# Altium project freedomport.PrjPcb
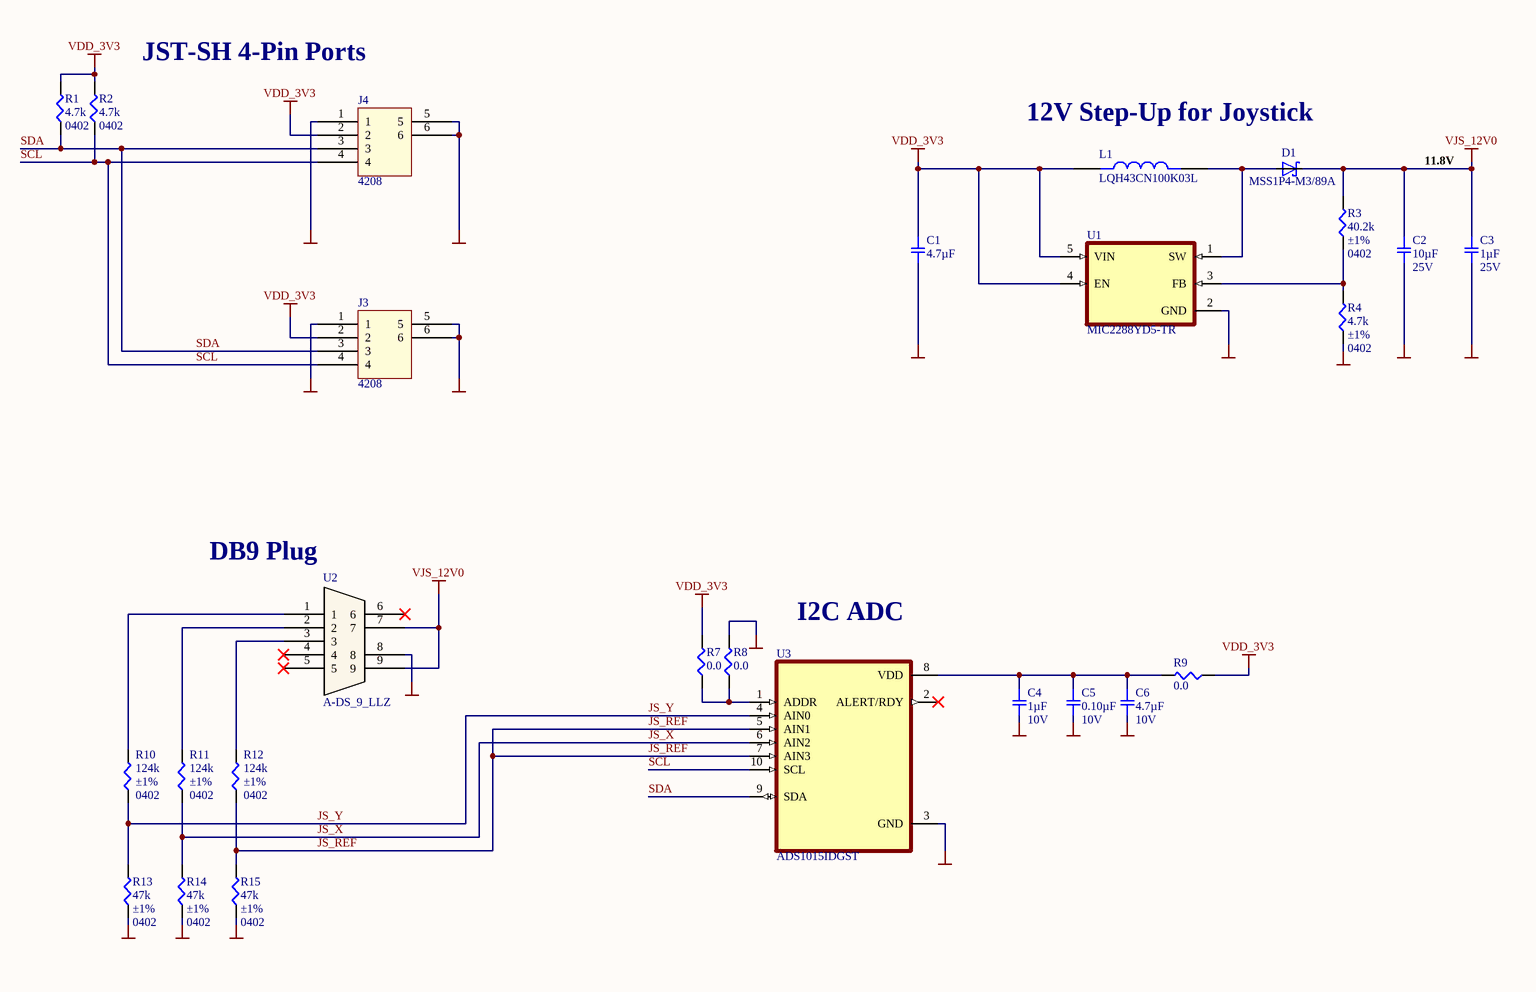
[diagram p0: freedomport.SchDoc]
1 sheet, 26 parts. Net scope: global (net labels, ports and power ports of the same name join across sheets).
Board file: freedomport.PcbDoc

## Sheet freedomport.SchDoc: FreedomPort
size Tabloid; Author: dnv32; DrawnBy: dnv32; Organization: Altium Limited; Address1: 1600 Amphitheatre Pkwy, Mountain View CA 94043; DocumentNumber: N/A; Revision: 1; SheetNumber: 1; SheetTotal: 1

### Parts
C1  4.7µF  [SMD-0603C]
C2  10µF  Voltage: 25V  [SMD-0603C]
C3  1µF  Voltage: 25V  [SMD-0402C]
C4  1µF  Voltage: 10V  [SMD-0402C]
C5  0.10µF  Voltage: 10V  [SMD-0402C]
C6  4.7µF  Voltage: 10V  [SMD-0402C]
D1  MSS1P4-M3/89A  [DIODE_MSS1P4-M3/89A]
J3  4208  [4208]
J4  4208  [4208]
L1  LQH43CN100K03L  [IND_LQH43CN100K03L]
R1  4.7k  Supplier Device Package: 0402  [SMD-0402-RES]
R2  4.7k  Supplier Device Package: 0402  [SMD-0402-RES]
R3  40.2k  Tolerance: ±1%  Supplier Device Package: 0402  [SMD-0402-RES]
R4  4.7k  Tolerance: ±1%  Supplier Device Package: 0402  [SMD-0402-RES]
R7  0.0  [SMD-0402-RES]
R8  0.0  [SMD-0402-RES]
R9  0.0  [SMD-0402-RES]
R10  124k  Tolerance: ±1%  Supplier Device Package: 0402  [SMD-0402-RES]
R11  124k  Tolerance: ±1%  Supplier Device Package: 0402  [SMD-0402-RES]
R12  124k  Tolerance: ±1%  Supplier Device Package: 0402  [SMD-0402-RES]
R13  47k  Tolerance: ±1%  Supplier Device Package: 0402  [SMD-0402-RES]
R14  47k  Tolerance: ±1%  Supplier Device Package: 0402  [SMD-0402-RES]
R15  47k  Tolerance: ±1%  Supplier Device Package: 0402  [SMD-0402-RES]
U1  MIC2288YD5-TR  [SOT95P280X100-5N]
U2  A-DS_9_LLZ  [A-DS_9_LLZ]
U3  ADS1015IDGST  [SOP50P490X110-10N]

### Nets
GND: C1.2 C2.2 C3.2 C4.2 C5.2 C6.2 J3.1 J3.5 J3.6 J4.1 J4.5 J4.6 R4.1 R8.2 R13.1 R14.1 R15.1 U1.2(GND) U2.8 U3.3(GND)
VDD_3V3: C1.1 J3.2 J4.2 L1.1 R1.2 R2.2 R7.2 R9.1 U1.4(EN) U1.5(VIN)
VJS_12V0: C2.1 C3.1 D1.1(C) R3.2 U2.7 U2.9
JS_REF: R12.1 R15.2 U3.5(AIN1) U3.7(AIN3)
JS_X: R11.1 R14.2 U3.6(AIN2)
JS_Y: R10.1 R13.2 U3.4(AIN0)
SCL: J3.4 J4.4 R2.1 U3.10(SCL)
SDA: J3.3 J4.3 R1.1 U3.9(SDA)
NetC4_1: C4.1 C5.1 C6.1 R9.2 U3.8(VDD)
NetD1_2: D1.2(A) L1.2 U1.1(SW)
NetR3_1: R3.1 R4.2 U1.3(FB)
NetR7_1: R7.1 R8.1 U3.1(ADDR)
NetR10_2: R10.2 U2.1
NetR11_2: R11.2 U2.2
NetR12_2: R12.2 U2.3

Not connected (* = marked no-connect by the designer): U2 4* 5* 6*; U3 2(ALERT/RDY)*

### Notes on the sheet
- JST-SH 4-Pin Ports
- 12V Step-Up for Joystick
- 11.8V
- (near U2) DB9 Plug
- I2C ADC
- GPN:
- Title:
- Revision:
- Size:
- Tabloid
- Author:
- Reviewers:
- Date:
- Time:
- Sheet
- of

### Library data of the parts
C1 = GRM188R61C475KAAJD: CAP CER 4.7UF 16V X5R 0603; Manufacturer: Murata Electronics North America; Factory Stock: 0; Unit Price (USD): 0.3; Minimum Quantity: 1; Tolerance: ±10%; Datasheets: http://www.murata.com/~/media/webrenewal/support/library/catalog/products/capacitor/mlcc/c02e.pdf; Image: //media.digikey.com/Renders/Murata%20Renders/ZRB-SERIES-0402.jpg; Digi-Key Part Number: 490-10481-1-ND; Part Number: GRM188R61C475KAAJD; Quantity Available: 5977; @ qty: 0; Packaging: Cut Tape (CT); Series: GRM; Part Status: Active; Value: 4.7µF; Voltage: 16V; Temperature Coefficient: X5R; Operating Temperature: -55°C ~ 85°C; Features: Derating Recommended; Ratings: -; Applications: General Purpose; Mounting Type: Surface Mount, MLCC; Package / Case: 0603 (1608 Metric); Size / Dimension: 0.063" L x 0.031" W (1.60mm x 0.80mm); Height - Seated (Max): -; Thickness (Max): 0.037" (0.95mm); Lead Spacing: -; Lead Style: -
C2 = GRM188R61E106MA73D: CAP CER 10UF 25V X5R 0603; Manufacturer: Murata Electronics North America; Factory Stock: 0; Unit Price (USD): 0.36; Minimum Quantity: 1; Tolerance: ±20%; Datasheets: http://www.murata.com/~/media/webrenewal/support/library/catalog/products/capacitor/mlcc/c02e.pdf; Image: //media.digikey.com/Renders/Murata%20Renders/ZRB-SERIES-0402.jpg; Digi-Key Part Number: 490-7202-1-ND; Part Number: GRM188R61E106MA73D; Quantity Available: 169100; @ qty: 0; Packaging: Cut Tape (CT); Series: GRM; Part Status: Active; Value: 10µF; Temperature Coefficient: X5R; Operating Temperature: -55°C ~ 85°C; Features: -; Ratings: -; Applications: General Purpose; Mounting Type: Surface Mount, MLCC; Package / Case: 0603 (1608 Metric); Size / Dimension: 0.063" L x 0.031" W (1.60mm x 0.80mm); Height - Seated (Max): -; Thickness (Max): 0.031" (0.80mm); Lead Spacing: -; Lead Style: -
C3 = GRM155R61E105KA12D: CAP CER 1UF 25V X5R 0402; Manufacturer: Murata Electronics North America; Factory Stock: 0; Unit Price (USD): 0.1; Minimum Quantity: 1; Tolerance: ±10%; Datasheets: http://www.murata.com/~/media/webrenewal/support/library/catalog/products/capacitor/mlcc/c02e.pdf; Image: //media.digikey.com/Renders/Murata%20Renders/ZRB-SERIES-0402.jpg; Digi-Key Part Number: 490-10017-1-ND; Part Number: GRM155R61E105KA12D; Quantity Available: 2355; @ qty: 0; Packaging: Cut Tape (CT); Series: GRM; Part Status: Active; Value: 1µF; Temperature Coefficient: X5R; Operating Temperature: -55°C ~ 85°C; Features: Derating Recommended; Ratings: -; Applications: General Purpose; Mounting Type: Surface Mount, MLCC; Package / Case: 0402 (1005 Metric); Size / Dimension: 0.039" L x 0.020" W (1.00mm x 0.50mm); Height - Seated (Max): -; Thickness (Max): 0.022" (0.55mm); Lead Spacing: -; Lead Style: -
C4 = GRM155R61A105KE15D: CAP CER 1UF 10V X5R 0402; Manufacturer: Murata Electronics North America; Factory Stock: 0; Unit Price (USD): 0.1; Minimum Quantity: 1; Tolerance: ±10%; Datasheets: http://www.murata.com/~/media/webrenewal/support/library/catalog/products/capacitor/mlcc/c02e.pdf; Image: //media.digikey.com/Renders/Murata%20Renders/ZRB-SERIES-0402.jpg; Digi-Key Part Number: 490-3890-1-ND; Part Number: GRM155R61A105KE15D; Quantity Available: 6162668; @ qty: 0; Packaging: Cut Tape (CT); Series: GRM; Part Status: Active; Value: 1µF; Temperature Coefficient: X5R; Operating Temperature: -55°C ~ 85°C; Features: -; Ratings: -; Applications: General Purpose; Mounting Type: Surface Mount, MLCC; Package / Case: 0402 (1005 Metric); Size / Dimension: 0.039" L x 0.020" W (1.00mm x 0.50mm); Height - Seated (Max): -; Thickness (Max): 0.022" (0.55mm); Lead Spacing: -; Lead Style: -
C5 = GRM152R61A104KE19D: CAP CER 0.1UF 10V X5R 0402; Manufacturer: Murata Electronics North America; Factory Stock: 0; Unit Price (USD): 0.16; Minimum Quantity: 1; Tolerance: ±10%; Datasheets: http://www.murata.com/~/media/webrenewal/support/library/catalog/products/capacitor/mlcc/c02e.pdf; Image: //media.digikey.com/Renders/Murata%20Renders/ZRB-SERIES-0402.jpg; Digi-Key Part Number: 490-10008-1-ND; Part Number: GRM152R61A104KE19D; Quantity Available: 80241; @ qty: 0; Packaging: Cut Tape (CT); Series: GRM; Part Status: Active; Value: 0.10µF; Temperature Coefficient: X5R; Operating Temperature: -55°C ~ 85°C; Features: Derating Recommended; Ratings: -; Applications: General Purpose; Mounting Type: Surface Mount, MLCC; Package / Case: 0402 (1005 Metric); Size / Dimension: 0.039" L x 0.020" W (1.00mm x 0.50mm); Height - Seated (Max): -; Thickness (Max): 0.009" (0.22mm); Lead Spacing: -; Lead Style: -
C6 = ZRB15XR61A475KE01D: CAP CER 4.7UF 10V X5R 0402; Manufacturer: Murata Electronics North America; Factory Stock: 0; Unit Price (USD): 0.28; Minimum Quantity: 1; Tolerance: ±10%; Datasheets: http://search.murata.co.jp/Ceramy/image/img/A01X/G101/ENG/ZRB15XR61A475KE01-01.pdf; Image: //media.digikey.com/Renders/Murata%20Renders/ZRB-SERIES-0402.jpg; Digi-Key Part Number: 490-13252-1-ND; Part Number: ZRB15XR61A475KE01D; Quantity Available: 23076; @ qty: 0; Packaging: Cut Tape (CT); Series: ZRB; Part Status: Active; Value: 4.7µF; Temperature Coefficient: X5R; Operating Temperature: -55°C ~ 85°C; Features: Derating Recommended, Interposer Termination; Ratings: -; Applications: Acoustic Noise Reduction; Mounting Type: Surface Mount, MLCC; Package / Case: 0402 (1005 Metric); Size / Dimension: 0.039" L x 0.020" W (1.00mm x 0.50mm); Height - Seated (Max): -; Thickness (Max): 0.031" (0.80mm); Lead Spacing: -; Lead Style: -
D1 = MSS1P4-M3/89A: Diode Schottky 40V 1A Surface Mount MicroSMP (DO-219AD); MF: Vishay; Digi-Key_Part_Number: MSS1P4-M3/89AGICT-ND; Value: *; MP: MSS1P4-M3/89A; SnapEDA_Link: https://www.snapeda.com/parts/MSS1P4-M3/89A/Vishay%20Semiconductor%20Diodes%20Division/view-part/543169/?ref=snap; Package: MicroSMP Vishay Semiconductor
L1 = LQH43CN100K03L: Inductor with Inductance: 10uH Tol. +/-10%, Package: 1812 _4532_; MF: Murata; Price: None; Availability: Unavailable; SnapEDA_Link: https://www.snapeda.com/parts/LQH43CN100K03L/Murata/view-part/4546965/?ref=snap; Value: *; MP: LQH43CN100K03L; Package: NONSTANDARD
R1 R2 = ERJ-2GEJ472X: RES SMD 4.7K OHM 5% 1/10W 0402; Manufacturer: Panasonic Electronic Components; Factory Stock: 0; Unit Price (USD): 0.00350; @ qty: 1500; Minimum Quantity: 1; Power (Watts): 0.1W, 1/10W; Temperature Coefficient: ±200ppm/°C; Part Number: ERJ-2GEJ472X; Datasheets: http://industrial.panasonic.com/www-cgi/jvcr13pz.cgi?E+PZ+3+AOA0001+ERJ2GEJ472X+7+WW; Image: //media.digikey.com/Photos/Panasonic%20Photos/ERJ-PA2-Series.jpg; Digi-Key Part Number: P4.7KJCT-ND; Quantity Available: 8551774; Packaging: Cut Tape (CT); Series: ERJ; Part Status: Active; Value: 4.7k; Tolerance: ±5%; Composition: Thick Film; Features: Automotive AEC-Q200; Operating Temperature: -55°C ~ 155°C; Package / Case: 0402 (1005 Metric); Size / Dimension: 0.039" L x 0.020" W (1.00mm x 0.50mm); Height - Seated (Max): 0.016" (0.40mm); Number of Terminations: 2; Failure Rate: -
R3 = ERJ-2RKF4022X: RES SMD 40.2K OHM 1% 1/10W 0402; Manufacturer: Panasonic Electronic Components; Factory Stock: 0; Unit Price (USD): 0.00496; @ qty: 1500; Minimum Quantity: 1; Power (Watts): 0.1W, 1/10W; Temperature Coefficient: ±100ppm/°C; Part Number: ERJ-2RKF4022X; Datasheets: http://industrial.panasonic.com/www-cgi/jvcr13pz.cgi?E+PZ+3+AOA0002+ERJ2RKF4022X+7+WW; Image: //media.digikey.com/Photos/Panasonic%20Photos/ERJ-PA2-Series.jpg; Digi-Key Part Number: P40.2KLCT-ND; Quantity Available: 272146; Packaging: Cut Tape (CT); Series: ERJ; Part Status: Active; Value: 40.2k; Composition: Thick Film; Features: Automotive AEC-Q200; Operating Temperature: -55°C ~ 155°C; Package / Case: 0402 (1005 Metric); Size / Dimension: 0.039" L x 0.020" W (1.00mm x 0.50mm); Height - Seated (Max): 0.016" (0.40mm); Number of Terminations: 2; Failure Rate: -
R4 = ERJ-2RKF4701X: RES SMD 4.7K OHM 1% 1/10W 0402; Manufacturer: Panasonic Electronic Components; Factory Stock: 0; Unit Price (USD): 0.00496; @ qty: 1500; Minimum Quantity: 1; Power (Watts): 0.1W, 1/10W; Temperature Coefficient: ±100ppm/°C; Part Number: ERJ-2RKF4701X; Datasheets: http://industrial.panasonic.com/www-cgi/jvcr13pz.cgi?E+PZ+3+AOA0002+ERJ2RKF4701X+7+WW; Image: //media.digikey.com/Photos/Panasonic%20Photos/ERJ-PA2-Series.jpg; Digi-Key Part Number: P4.70KLCT-ND; Quantity Available: 1881807; Packaging: Cut Tape (CT); Series: ERJ; Part Status: Active; Value: 4.7k; Composition: Thick Film; Features: Automotive AEC-Q200; Operating Temperature: -55°C ~ 155°C; Package / Case: 0402 (1005 Metric); Size / Dimension: 0.039" L x 0.020" W (1.00mm x 0.50mm); Height - Seated (Max): 0.016" (0.40mm); Number of Terminations: 2; Failure Rate: -
R7-R9 = ERJ-2GE0R00X: RES SMD 0.0OHM JUMPER 1/10W 0402; Manufacturer: Panasonic Electronic Components; Factory Stock: 0; Unit Price (USD): 0.00384; @ qty: 1500; Minimum Quantity: 1; Power (Watts): 0.1W, 1/10W; Part Number: ERJ-2GE0R00X; Datasheets: http://industrial.panasonic.com/www-cgi/jvcr13pz.cgi?E+PZ+3+AOA0001+ERJ2GE0R00X+7+WW; Image: //media.digikey.com/Photos/Panasonic%20Photos/ERJ-PA2-Series.jpg; Digi-Key Part Number: P0.0JCT-ND; Quantity Available: 3152483; Packaging: Cut Tape (CT); Series: ERJ; Part Status: Active; Value: 0.0; Tolerance: Jumper; Composition: Thick Film; Features: Automotive AEC-Q200; Temperature Coefficient: -; Operating Temperature: -55°C ~ 155°C; Package / Case: 0402 (1005 Metric); Supplier Device Package: 0402; Size / Dimension: 0.039" L x 0.020" W (1.00mm x 0.50mm); Height - Seated (Max): 0.016" (0.40mm); Number of Terminations: 2; Failure Rate: -
R10-R12 = ERJ-2RKF1243X: RES SMD 124K OHM 1% 1/10W 0402; Manufacturer: Panasonic Electronic Components; Factory Stock: 0; Unit Price (USD): 0.00496; @ qty: 1500; Minimum Quantity: 1; Power (Watts): 0.1W, 1/10W; Temperature Coefficient: ±100ppm/°C; Part Number: ERJ-2RKF1243X; Datasheets: http://industrial.panasonic.com/www-cgi/jvcr13pz.cgi?E+PZ+3+AOA0002+ERJ2RKF1243X+7+WW; Image: //media.digikey.com/Photos/Panasonic%20Photos/ERJ-PA2-Series.jpg; Digi-Key Part Number: P124KLCT-ND; Quantity Available: 190703; Packaging: Cut Tape (CT); Series: ERJ; Part Status: Active; Value: 124k; Composition: Thick Film; Features: Automotive AEC-Q200; Operating Temperature: -55°C ~ 155°C; Package / Case: 0402 (1005 Metric); Size / Dimension: 0.039" L x 0.020" W (1.00mm x 0.50mm); Height - Seated (Max): 0.016" (0.40mm); Number of Terminations: 2; Failure Rate: -
R13-R15 = ERJ-2RKF4702X: RES SMD 47K OHM 1% 1/10W 0402; Manufacturer: Panasonic Electronic Components; Factory Stock: 0; Unit Price (USD): 0.00496; @ qty: 1500; Minimum Quantity: 1; Power (Watts): 0.1W, 1/10W; Temperature Coefficient: ±100ppm/°C; Part Number: ERJ-2RKF4702X; Datasheets: http://industrial.panasonic.com/www-cgi/jvcr13pz.cgi?E+PZ+3+AOA0002+ERJ2RKF4702X+7+WW; Image: //media.digikey.com/Photos/Panasonic%20Photos/ERJ-PA2-Series.jpg; Digi-Key Part Number: P47.0KLCT-ND; Quantity Available: 230515; Packaging: Cut Tape (CT); Series: ERJ; Part Status: Active; Value: 47k; Composition: Thick Film; Features: Automotive AEC-Q200; Operating Temperature: -55°C ~ 155°C; Package / Case: 0402 (1005 Metric); Size / Dimension: 0.039" L x 0.020" W (1.00mm x 0.50mm); Height - Seated (Max): 0.016" (0.40mm); Number of Terminations: 2; Failure Rate: -
U1 = MIC2288YD5-TR: Boost Switching Regulator IC Positive Adjustable 2.5V 1 Output 1.2A _Switch_ SOT-23-5 Thin, TSOT-23-5; MF: Microchip; MP: MIC2288YD5-TR; Availability: Unavailable; SnapEDA_Link: https://www.snapeda.com/parts/MIC2288YD5-TR/Microchip/view-part/552767/?ref=snap; Package: TSOT-23 Microchip; Price: None; Value: *
U3 = ADS1015IDGST: 12-Bit, 3.3kSPS, 4-Ch Delta-Sigma ADC With PGA, Oscillator, VREF, Comparator and I2C Interface 10-VSSOP -40 to 125; MF: Texas Instruments; Mouser-Purchase-URL: https://snapeda.com/shop?store=Mouser&id=425936; Price: None; Availability: Good; Package: VSSOP-10 Texas Instruments; DigiKey-Purchase-URL: https://snapeda.com/shop?store=DigiKey&id=425936; MP: ADS1015IDGST; Value: *; SnapEDA_Link: https://www.snapeda.com/parts/ADS1015IDGST/Texas%20Instruments/view-part/425936/?ref=snap; Texas_Instruments-Purchase-URL: https://snapeda.com/shop?store=Texas+Instruments&id=425936; BuyPart: https://www.snapeda.com/parts/ADS1015IDGST/Texas%20Instruments/view-part/425936/?ref=eda

## Assembly variants
Populated: not fitted C1 C2 P1 P2 R7 R13